# Altium project PCB_Project_1.PrjPcb
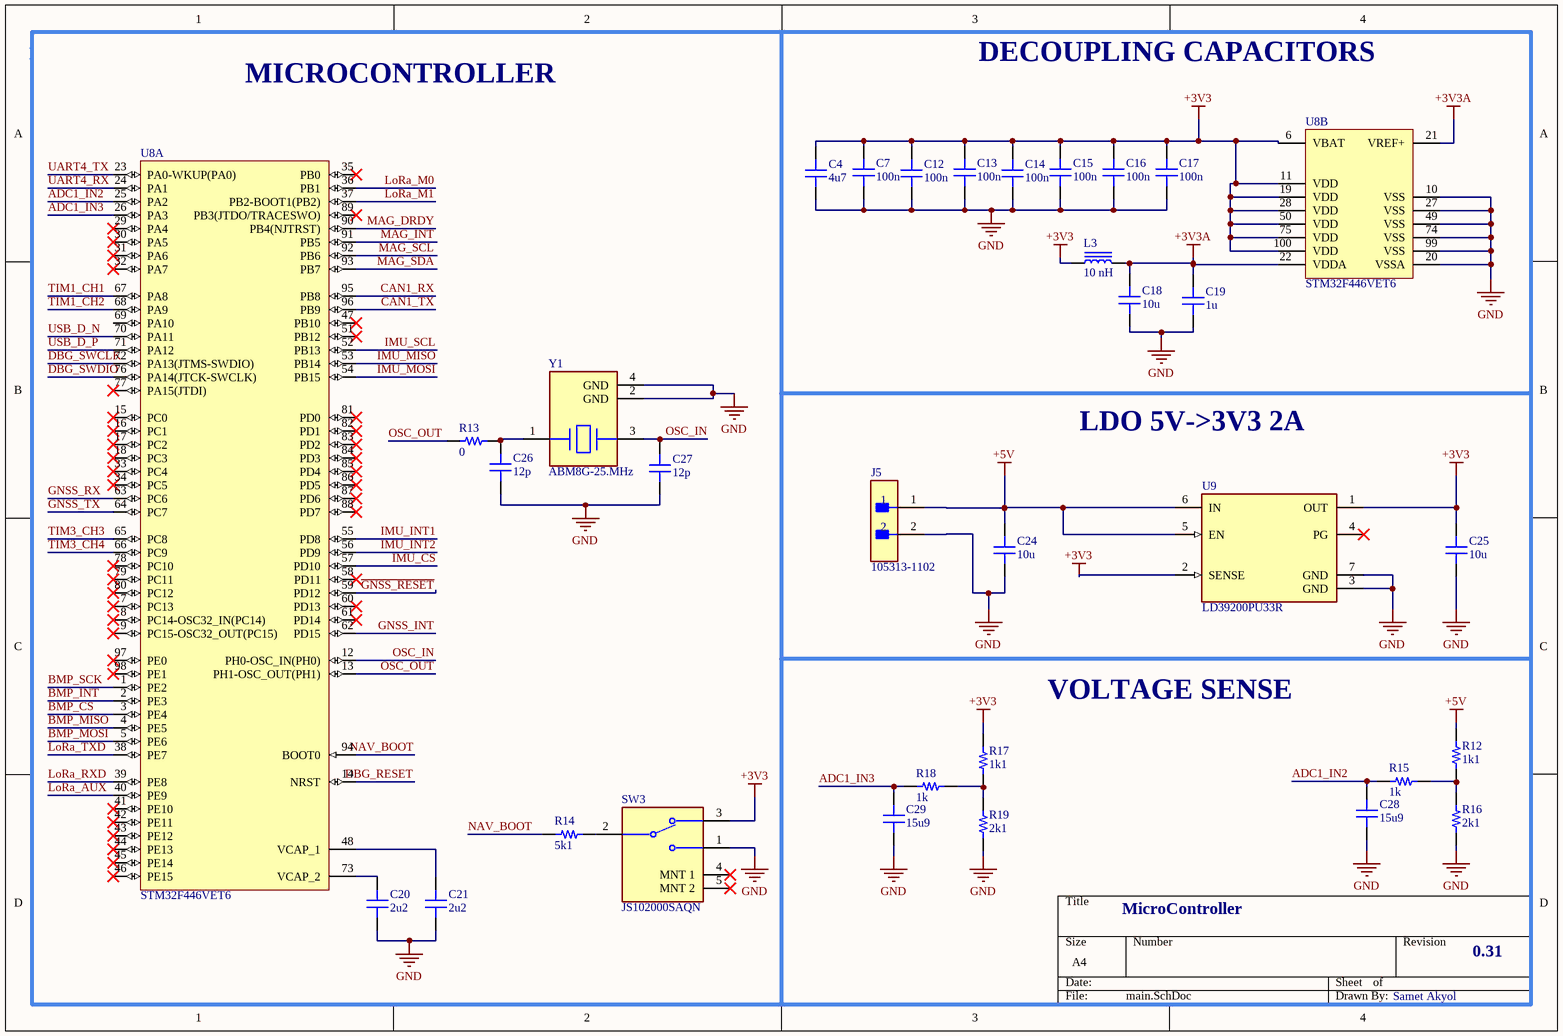
[diagram p0: main.SchDoc]
3 sheets, 75 parts. Net scope: global (net labels, ports and power ports of the same name join across sheets).
Board file: NAV_Computer.PcbDoc
Sheets:
  main.SchDoc
  Sensors.SchDoc
  Peripheral.SchDoc

## Sheet main.SchDoc: SSSSS
size A4; Date: 24.07.2024; Author: Samet Akyol; Revision: 0.1; SheetNumber: 1; SheetTotal: 3

### Parts
C4  4u7  [CAP 0402_1005]
C7  100n  [CAP 0402_1005]
C12  100n  [CAP 0402_1005]
C13  100n  [CAP 0402_1005]
C14  100n  [CAP 0402_1005]
C15  100n  [CAP 0402_1005]
C16  100n  [CAP 0402_1005]
C17  100n  [CAP 0402_1005]
C18  10u  [CAP 0402_1005]
C19  1u  [CAP 0402_1005]
C20  2u2  [CAP 0402_1005]
C21  2u2  [CAP 0402_1005]
C24  10u  [CAP 0603_1608]
C25  10u  [CAP 0603_1608]
C26  12p  [CAP 0402_1005]
C27  12p  [CAP 0402_1005]
C28  15u9  [CAP 0402_1005]
C29  15u9  [CAP 0402_1005]
J5  105313-1102  [FP-105313-1102-MFG]
L3  10 nH  [IND 0402_1005 RF WW]
R12  1k1  [RES 0402_1005]
R13  0  [RES 0402_1005]
R14  5k1  [RES 0402_1005]
R15  1k  [RES 0402_1005]
R16  2k1  [RES 0402_1005]
R17  1k1  [RES 0402_1005]
R18  1k  [RES 0402_1005]
R19  2k1  [RES 0402_1005]
SW3  JS102000SAQN  [FP-JS102000SAQN-MFG]
U8  STM32F446VET6  [STM-LQFP100_L]  (parts A,B of 2)
U9  LD39200PU33R  [FP-DFN6-7946637-MFG]
Y1  ABM8G-25.MHz  [FP-ABM8G-MFG]

### Nets
+3V3: C4.2 C7.2 C12.2 C13.2 C14.2 C15.2 C16.2 C17.2 C25.2 L3.1 R17.2 SW3.3 U8.6(VBAT) U8.11(VDD) U8.19(VDD) U8.28(VDD) U8.50(VDD) U8.75(VDD) U8.100(VDD) U9.1(OUT) U9.2(SENSE)
+3V3A: C18.2 C19.2 L3.2 U8.21(VREF+) U8.22(VDDA)
+5V: C24.2 J5.1 R12.2 U9.5(EN) U9.6(IN)
GND: C4.1 C7.1 C12.1 C13.1 C14.1 C15.1 C16.1 C17.1 C18.1 C19.1 C20.1 C21.1 C24.1 C25.1 C26.1 C27.1 C28.1 C29.1 J5.2 R16.2 R19.2 SW3.1 U8.10(VSS) U8.20(VSSA) U8.27(VSS) U8.49(VSS) U8.74(VSS) U8.99(VSS) U9.3(GND) U9.7(GND) Y1.2(GND) Y1.4(GND)
ADC1_IN2: C28.2 R15.2 U8.25(PA2)
ADC1_IN3: C29.2 R18.2 U8.26(PA3)
BMP_CS: U8.3(PE4)
BMP_INT: U8.2(PE3)
BMP_MISO: U8.4(PE5)
BMP_MOSI: U8.5(PE6)
BMP_SCK: U8.1(PE2)
CAN1_RX: U8.95(PB8)
CAN1_TX: U8.96(PB9)
DBG_RESET: U8.14(NRST)
DBG_SWCLK: U8.72(PA13(JTMS-SWDIO))
DBG_SWDIO: U8.76(PA14(JTCK-SWCLK))
~{GNSS_RESET}: U8.59(PD12)
GNSS_INT: U8.62(PD15)
GNSS_RX: U8.63(PC6)
GNSS_TX: U8.64(PC7)
IMU_CS: U8.57(PD10)
IMU_INT1: U8.55(PD8)
IMU_INT2: U8.56(PD9)
IMU_MISO: U8.53(PB14)
IMU_MOSI: U8.54(PB15)
IMU_SCL: U8.52(PB13)
LoRa_AUX: U8.40(PE9)
LoRa_M0: U8.36(PB1)
LoRa_M1: U8.37(PB2-BOOT1(PB2))
LoRa_RXD: U8.39(PE8)
LoRa_TXD: U8.38(PE7)
MAG_DRDY: U8.90(PB4(NJTRST))
MAG_INT: U8.91(PB5)
MAG_SCL: U8.92(PB6)
MAG_SDA: U8.93(PB7)
NAV_BOOT: R14.2 U8.94(BOOT0)
OSC_IN: C27.2 U8.12(PH0-OSC_IN(PH0)) Y1.3
OSC_OUT: R13.1 U8.13(PH1-OSC_OUT(PH1))
TIM1_CH1: U8.67(PA8)
TIM1_CH2: U8.68(PA9)
TIM3_CH3: U8.65(PC8)
TIM3_CH4: U8.66(PC9)
UART4_RX: U8.24(PA1)
UART4_TX: U8.23(PA0-WKUP(PA0))
USB_D_N: U8.70(PA11)
USB_D_P: U8.71(PA12)
NetC20_2: C20.2 U8.73(VCAP_2)
NetC21_2: C21.2 U8.48(VCAP_1)
NetC26_2: C26.2 R13.2 Y1.1
NetR12_1: R12.1 R15.1 R16.1
NetR14_1: R14.1 SW3.2(C)
NetR17_1: R17.1 R18.1 R19.1

Not connected (* = marked no-connect by the designer): SW3 4(MNT_1)* 5(MNT_2)*; U8 7(PC13)* 8(PC14-OSC32_IN(PC14))* 9(PC15-OSC32_OUT(PC15))* 15(PC0)* 16(PC1)* 17(PC2)* 18(PC3)* 29(PA4)* 30(PA5)* 31(PA6)* 32(PA7)* 33(PC4)* 34(PC5)* 35(PB0)* 41(PE10)* 42(PE11)* 43(PE12)* 44(PE13)* 45(PE14)* 46(PE15)* 47(PB10)* 51(PB12)* 58(PD11)* 60(PD13)* 61(PD14)* 69(PA10) 77(PA15(JTDI))* 78(PC10)* 79(PC11)* 80(PC12)* 81(PD0)* 82(PD1)* 83(PD2)* 84(PD3)* 85(PD4)* 86(PD5)* 87(PD6)* 88(PD7)* 89(PB3(JTDO/TRACESWO))* 97(PE0)* 98(PE1)*; U9 4(PG)*

### Notes on the sheet
- MICROCONTROLLER
- DECOUPLING CAPACITORS
- LDO 5V->3V3 2A
- VOLTAGE SENSE
- MicroController
- 0.31
- Samet Akyol

### Library data of the parts
C4 C7 C12-C21 C26-C29 = MD0402BB104K100NGHT-EM: CAP CER 0.1UF 10V X7R 0402; manufacturer: Knowles Novacap; Capacitance: 0.1 µF; Tolerance: ±10%; Part Number: MD0402BB104K100NGHT-EM; Applications: Medical, Non-Critical; componentlink1description: Datasheet; componentlink1url: https://mm.digikey.com/Volume0/opasdata/d220001/medias/docus/5546/MD Series R3.pdf; componentlink2description: DigiKey Link; componentlink2url: https://www.digikey.com/en/products/detail/knowles-novacap/MD0402BB104K100NGHT-EM/21406861; Device Package: 0402 (1005 Metric); lastupdated: 9.02.2024 20:03:17; Lifecycle Status: Active; Minimum Order: 1; Mounting Type: Surface Mount, MLCC; Operating Temperature: -55°C ~ 125°C; Package / Case: 0402 (1005 Metric); packaging: TapeAndReel; partid: 56675; price: 1.21; series: MD; Supplier 1: DigiKey; Supplier Part Number 1: 1763-MD0402BB104K100NGHT-EMCT-ND; Temperature Coefficient: X7R; Voltage - Rated: 10V
  C4: Value: 4u7
  C7 C12-C17: Value: 100n
  C18: Value: 10u
  C19: Value: 1u
  C20 C21: Value: 2u2
  C26 C27: Value: 12p
  C28 C29: Value: 15u9
C24 C25 = GRM1885C1H362JA01D: CAP CER 3600PF 50V C0G/NP0 0603; manufacturer: Murata Electronics; Temperature Coefficient: C0G, NP0; Tolerance: ±5%; Part Number: GRM1885C1H362JA01D; Value: 10u; Applications: General Purpose; Capacitance: 3600 pF; componentlink1description: Datasheet; componentlink1url: https://www.murata.com/~/media/webrenewal/support/library/catalog/products/capacitor/mlcc/c02e.ashx?la=en-us; componentlink2description: DigiKey Link; componentlink2url: https://www.digikey.com/en/products/detail/murata-electronics/GRM1885C1H362JA01D/2611163; Device Package: 0603 (1608 Metric); lastupdated: 9.02.2024 20:10:10; Lifecycle Status: Active; Minimum Order: 1; Mounting Type: Surface Mount, MLCC; Operating Temperature: -55°C ~ 125°C; Package / Case: 0603 (1608 Metric); packaging: TapeAndReel; partid: 15929; Part Status: Active; price: 0.01; series: GRM; Size / Dimension: 0.063" L x 0.031" W (1.60mm x 0.80mm); Supplier 1: DigiKey; Supplier Part Number 1: 490-6386-1-ND; Thickness (Max): 0.035" (0.90mm); Voltage - Rated: 50V
J5 = CMP-04776-000341-1: CONN HEADER R/A 2POS 2.5MM
L3 = LQW15AN10NG80D: FIXED IND 10NH 1.4A 0.081OHM SMD; Manufacturer: Murata Electronics; DC Resistance (DCR): 81mOhm Max; Frequency - Self Resonant: 6GHz; Inductance Frequency - Test: 100 MHz; Material - Core: Non-Magnetic; Q @ Freq: 31 @ 250MHz; Shielding: Unshielded; Tolerance: ±2%; Type: Drum Core, Wirewound; Part Number: LQW15AN10NG80D; ComponentLink1Description: Datasheet; ComponentLink1URL: https://search.murata.co.jp/Ceramy/image/img/P02/JELF243A-0100.pdf; ComponentLink2Description: DigiKey Link; ComponentLink2URL: https://www.digikey.com/en/products/detail/murata-electronics/LQW15AN10NG80D/4905881; Current Rating (Amps): 1.4 A; Device Package: 0402 (1005 Metric); Height - Seated (Max): 0.024" (0.60mm); Inductance: 10 nH; LastUpdated: 11.03.2024 07:55:40; Lifecycle Status: Active; Minimum Order: 1; Mounting Type: Surface Mount; Operating Temperature: -55°C ~ 125°C; Package / Case: 0402 (1005 Metric); Packaging: TapeAndReel; PartId: 162; Part Status: Active; Price: 0.07; Series: LQW15; Size / Dimension: 0.039" L x 0.024" W (1.00mm x 0.60mm); Supplier 1: DigiKey; Supplier Part Number 1: 490-14708-1-ND; Value: 10 nH
R12 R14-R19 = RP73PF1E249KBTD: RES 249K OHM 0.1% 1/10W 0402; Manufacturer: TE Connectivity Passive Product; Power (Watts): 0.1W, 1/10W; Resistance: 249 kOhms; Temperature Coefficient: ±25ppm/°C; Part Number: RP73PF1E249KBTD; ComponentLink1Description: Datasheet; ComponentLink1URL: https://www.te.com/commerce/DocumentDelivery/DDEController?Action=srchrtrv&DocNm=1773272&DocType=DS&DocLang=English; ComponentLink2Description: DigiKey Link; ComponentLink2URL: https://www.digikey.com/en/products/detail/te-connectivity-passive-product/RP73PF1E249KBTD/8261091; Composition: Thin Film; Device Package: 0402 (1005 Metric); Height - Seated (Max): 0.014" (0.35mm); LastUpdated: 9.02.2024 20:30:24; Lifecycle Status: Active; Minimum Order: 1; Number of Terminations: 2; Operating Temperature: -55°C ~ 155°C; Package / Case: 0402 (1005 Metric); Packaging: TapeAndReel; PartId: 2418; Part Status: Active; Price: 0.07; Series: RP73, Holsworthy; Size / Dimension: 0.039" L x 0.020" W (1.00mm x 0.50mm); Supplier 1: DigiKey; Supplier Part Number 1: A127549CT-ND; Supplier Device Package: 0402; Tolerance: ±0.1%
  R12 R17: Value: 1k1
  R14: Value: 5k1
  R15 R18: Value: 1k
  R16 R19: Value: 2k1
R13 = RC0402FR-07270RL: RES 270 OHM 1% 1/16W 0402; Manufacturer: Yageo; Power (Watts): 0.063W, 1/16W; Resistance: 270 Ohms; Temperature Coefficient: ±100ppm/°C; Part Number: RC0402FR-07270RL; Value: 0; ComponentLink1Description: Datasheet; ComponentLink1URL: https://www.yageo.com/upload/media/product/productsearch/datasheet/rchip/PYu-RC_Group_51_RoHS_L_10.pdf; ComponentLink2Description: DigiKey Link; ComponentLink2URL: https://www.digikey.com/en/products/detail/yageo/RC0402FR-07270RL/2827584; Composition: Thick Film; Device Package: 0402 (1005 Metric); Features: Moisture Resistant; Height - Seated (Max): 0.016" (0.40mm); LastUpdated: 9.02.2024 20:30:23; Lifecycle Status: Active; Minimum Order: 1; Number of Terminations: 2; Operating Temperature: -55°C ~ 155°C; Package / Case: 0402 (1005 Metric); Packaging: CutTape; PartId: 2573; Part Status: Active; Price: 0.01; Series: RC_L; Size / Dimension: 0.039" L x 0.020" W (1.00mm x 0.50mm); Supplier 1: DigiKey; Supplier Part Number 1: 311-270LRCT-ND; Supplier Device Package: 0402; Tolerance: ±1%
SW3 = CMP-10038-000025-1: SWITCH SLIDE SPDT 1MA 5V; Actuator Material: Nylon; Contact Resistance: 70mR; Electrical Life: 15000Cycles; Actuator Length: 1.5mm; Switch Function: On-On; Actuator Type: Standard; Actuator Color: Black; Current Rating: 1mA; Throw Configuration: SPDT; Termination: Gull Wing; Housing Material: Nylon; Max Operating Temperature: 85°C; Max Voltage Rating (DC): 5V; Voltage Rating (DC): 5V; Contact Plating: Silver; Radiation Hardening: No; Package Quantity: 1; REACH SVHC: No SVHC; RoHS Compliant: Yes; Orientation: Right Angle; Max Current Rating: 1mA; Case/Package: SMD/SMT; Contact Current Rating: 1mA; Contact Material: Copper Alloy; Mount: Surface Mount; Flammability Rating: UL94 V-2; Packaging: Tape and Reel; Switch Travel: 1.5mm; Length: 7.8mm; Series: JS; Min Operating Temperature: -20°C; Depth: 4.82mm
U8 = CMP-0243-00220-1: ARM Cortex-M4 32-bit MCU+FPU, 512 KB Flash, 128 KB Internal RAM, 81 I/Os, 100-Pin LQFP, -40 to 85 degC, Tray; I/Os (High Current): 81; D/A Converter: 2; Internal RAM Size (kB): 128; FLASH Size (Prog) (kB): 512; Supply Voltage(Vcc) min (V): 1.7; Operating Frequency(F) (Processor speed) (MHz): 180; ComponentLink1Description: Manufacturer URL; ComponentLink1URL: http://www.st.com/; Core: ARM Cortex-M4; DatasheetVersion: Rev. 6; ComponentLink2Description: Datasheet; Package Description: LQFP100; Mounting Technology: Surface Mount; Package Reference: 100-Pin Low Profile Quad Flat Package, Body 14 x 14 mm, Pitch 0.5 mm; Packing: Tray; ComponentLink2URL: http://www.st.com/st-web-ui/static/active/en/resource/technical/document/datasheet/DM00141306.pdf
U9 = CMP-12153-000011-1: IC REG LINEAR 3.3V 2A 6DFN; Number of Outputs: 1; Max Input Voltage: 6V; Output Type: Fixed; Min Input Voltage: 1.25V; Dropout Voltage: 130mV; Operating Supply Current: 1mA; Number of Regulators: 1; Case/Package: DFN; Packaging: Tape and Reel; Output Current: 2A; Min Operating Temperature: -40°C; Mount: Surface Mount; Output Voltage: 3.3V; Max Operating Temperature: 125°C; Lead Free: Lead Free; Package Quantity: 3000
Y1 = CMP-2000-05733-3: Crystal 25MHz ±20ppm (Tol) ±30ppm (Stability) 18pF FUND 60Ω 4-Pin SMD T/R; Series Resistance: 60R; Length: 3.2mm; Depth: 2.5mm; Packaging: Tape and Reel; Min Operating Temperature: -40°C; Operating Frequency: 25 MHz; Lead Free: Lead Free; Number of Pins: 4; Frequency Tolerance: 20ppm; Radiation Hardening: No; Max Operating Temperature: 85°C; Termination: SMD/SMT; Frequency Stability: 30ppm; Frequency: 25MHz; Series: ABM8G; Mount: Surface Mount; Package Quantity: 1000; Height: 0.039inch; Width: 0.098inch; Case/Package: CSMD; ESR (Equivalent Series Resistance): 60R; Load Capacitance: 18pF; Tolerance: 20ppm

## Sheet Sensors.SchDoc
size A4; SheetNumber: 2; SheetTotal: 3
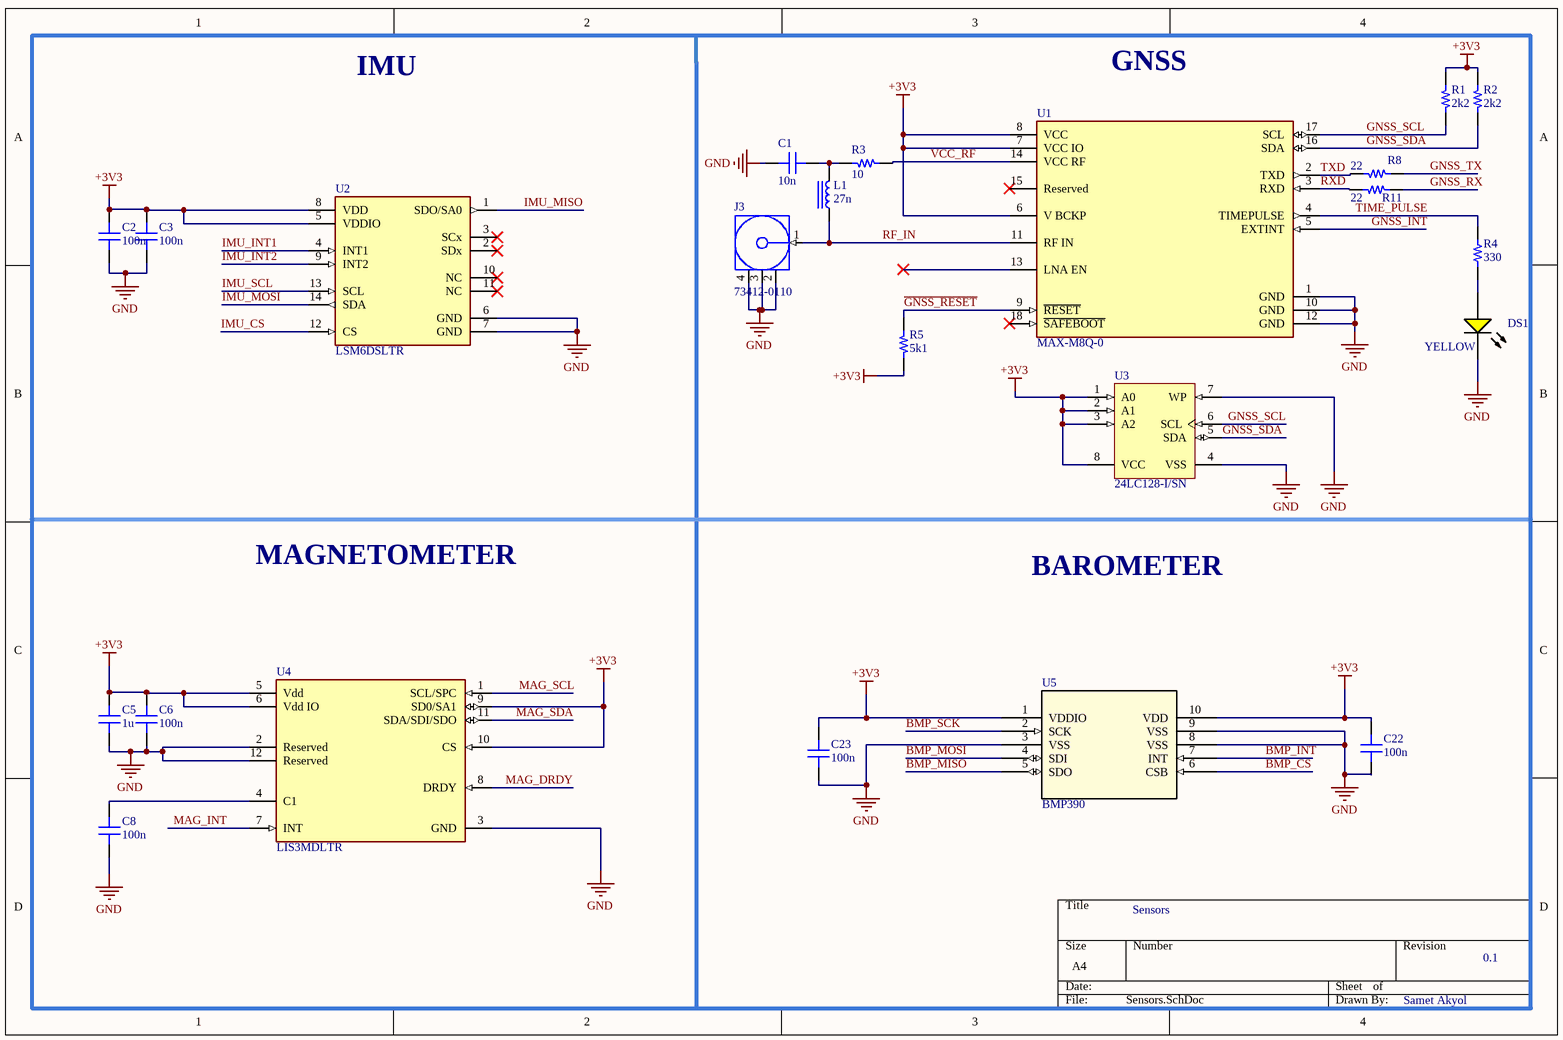
[diagram p1: Sensors.SchDoc]

### Parts
C1  10n  [CAP 0402_1005]
C2  100n  [CAP 0402_1005]
C3  100n  [CAP 0402_1005]
C5  1u  [CAP 0402_1005]
C6  100n  [CAP 0402_1005]
C8  100n  [CAP 0402_1005]
C22  100n  [CAP 0402_1005]
C23  100n  [CAP 0402_1005]
DS1  YELLOW  [VISH-TLMY1000_V]
J3  73412-0110  [MOLX-73412-0110_V]
L1  27n  [IND 0402_1005 RF WW]
R1  2k2  [RES 0402_1005]
R2  2k2  [RES 0402_1005]
R3  10  [RES 0402_1005]
R4  330  [RES 0603_1608]
R5  5k1  [RES 0402_1005]
R8  22  [RES 0402_1005]
R11  22  [RES 0402_1005]
U1  MAX-M8Q-0  [FP-MAX-M8Q-0-MFG]
U2  LSM6DSLTR  [FP-LGA-14L-DM00249496-MFG]
U3  24LC128-I/SN  [SOIC-SN8_M]
U4  LIS3MDLTR  [FP-VFLGA-12-8365767-MFG]
U5  BMP390  [10LGA_2X2X0p75_BOS-L]

### Nets
+3V3: C2.2 C3.2 C5.2 C6.2 C22.2 C23.2 R1.2 R2.2 R5.1 U1.6(V_BCKP) U1.7(VCC_IO) U1.8(VCC) U2.5(VDDIO) U2.8(VDD) U3.1(A0) U3.2(A1) U3.3(A2) U3.8(VCC) U4.5(Vdd) U4.6(Vdd_IO) U4.9(SD0/SA1) U4.10(CS) U5.1(VDDIO) U5.10(VDD)
GND: C1.2 C2.1 C3.1 C5.1 C6.1 C8.1 C22.1 C23.1 DS1.2(K) J3.2(GND) J3.3(GND) J3.4(GND) U1.1(GND) U1.10(GND) U1.12(GND) U2.6(GND) U2.7(GND) U3.4(VSS) U3.7(WP) U4.2(Reserved) U4.3(GND) U4.12(Reserved) U5.3(VSS) U5.8(VSS) U5.9(VSS)
BMP_CS: U5.6(CSB)
BMP_INT: U5.7(INT)
BMP_MISO: U5.5(SDO)
BMP_MOSI: U5.4(SDI)
BMP_SCK: U5.2(SCK)
~{GNSS_RESET}: R5.2 U1.9(~{RESET})
GNSS_INT: U1.5(EXTINT)
GNSS_RX: R11.1
GNSS_SCL: R1.1 U1.17(SCL) U3.6(SCL)
GNSS_SDA: R2.1 U1.16(SDA) U3.5(SDA)
GNSS_TX: R8.1
IMU_CS: U2.12(CS)
IMU_INT1: U2.4(INT1)
IMU_INT2: U2.9(INT2)
IMU_MISO: U2.1(SDO/SA0)
IMU_MOSI: U2.14(SDA)
IMU_SCL: U2.13(SCL)
MAG_DRDY: U4.8(DRDY)
MAG_INT: U4.7(INT)
MAG_SCL: U4.1(SCL/SPC)
MAG_SDA: U4.11(SDA/SDI/SDO)
RF_IN: J3.1(SIGNAL) L1.2 U1.11(RF_IN)
RXD: R11.2 U1.3(RXD)
TIME_PULSE: R4.2 U1.4(TIMEPULSE)
TXD: R8.2 U1.2(TXD)
VCC_RF: R3.2 U1.14(VCC_RF)
NetC1_1: C1.1 L1.1 R3.1
NetC8_2: C8.2 U4.4(C1)
NetDS1_1: DS1.1(A) R4.1

Not connected (* = marked no-connect by the designer): U1 13(LNA_EN)* 15(Reserved)* 18(~{SAFEBOOT})*; U2 2(SDx)* 3(SCx)* 10(NC)* 11(NC)*

### Notes on the sheet
- IMU <https://www.st.com/resource/en/datasheet/lsm6dsl.pdf>
- GNSS <https://www.u-blox.com/en/product/max-m8-series?legacy=Current#Documentation-&-resources>
- MAGNETOMETER
- BAROMETER
- Sensors
- 0.1
- Samet Akyol

### Library data of the parts
C1 = C0402C151F5GAC7867: CAP CER 150PF 50V NP0 0402; manufacturer: KEMET; Temperature Coefficient: C0G, NP0; Tolerance: ±1%; Part Number: C0402C151F5GAC7867; Value: 10n; Applications: General Purpose; Capacitance: 150 pF; componentlink1description: Datasheet; componentlink1url: https://api.kemet.com/component-edge/download/datasheet/C0402C151F5GAC7867.pdf; componentlink2description: DigiKey Link; componentlink2url: https://www.digikey.com/en/products/detail/kemet/C0402C151F5GAC7867/2196312; Device Package: 0402 (1005 Metric); Features: Low ESL; lastupdated: 9.02.2024 20:04:38; Lifecycle Status: Active; Minimum Order: 1; Mounting Type: Surface Mount, MLCC; Operating Temperature: -55°C ~ 125°C; Package / Case: 0402 (1005 Metric); packaging: TapeAndReel; partid: 1709; Part Status: Active; price: 0.40; series: SMD Comm C0G; Size / Dimension: 0.039" L x 0.020" W (1.00mm x 0.50mm); Supplier 1: DigiKey; Supplier Part Number 1: 399-14269-1-ND; Thickness (Max): 0.022" (0.55mm); Voltage - Rated: 50V
C2 C3 C5 C6 C8 C22 C23 = MD0402BB104K100NGHT-EM: as C4 on sheet main; Part Number: MD0402BB104K100NGHT-EM; Applications: Medical, Non-Critical; componentlink1description: Datasheet; componentlink1url: https://mm.digikey.com/Volume0/opasdata/d220001/medias/docus/5546/MD Series R3.pdf; componentlink2description: DigiKey Link; componentlink2url: https://www.digikey.com/en/products/detail/knowles-novacap/MD0402BB104K100NGHT-EM/21406861; Device Package: 0402 (1005 Metric); lastupdated: 9.02.2024 20:03:17; Lifecycle Status: Active; Minimum Order: 1; Mounting Type: Surface Mount, MLCC; Operating Temperature: -55°C ~ 125°C; Package / Case: 0402 (1005 Metric); packaging: TapeAndReel; partid: 56675; price: 1.21; series: MD; Supplier 1: DigiKey; Supplier Part Number 1: 1763-MD0402BB104K100NGHT-EMCT-ND; Temperature Coefficient: X7R; Voltage - Rated: 10V
  C2 C3 C6 C8 C22 C23: Value: 100n
  C5: Value: 1u
DS1 = CMP-2000-07255-1: Low Current LED, 40 mW, -40 to 100 degC, 2-Pin SMD, RoHS, Tape and Reel; Manufacturer: Vishay; Wavelength Typ: 595nm; Forward Current If: 2mA; Viewing Angle: 80°; Bulb Size: 1.6mmx0.8mm; Forward Voltage: 1.8V; Luminous Intensity: 7.5mcd; SVHC: ToBeAdvised; Automotive Qualification Standard: AEC-Q100; Lens Shape: Rectangular; LED Mounting: SMD; Mounting Technology: SurfaceMount; Packaging: CutTape; MSL: MSL2-1year; Datasheet URL: http://www.vishay.com/docs/83172/tlmo1000.pdf; Package Reference: TLMY1000; Manufacturer URL: http://www.vishay.com/; Package Description: 2-Pin Surface Mount Device, Body 1.6 x 0.8 mm; LED Colour: Yellow; Datasheet Version: Rev. 2.0, 09/2013; Product Range: -
J3 = CMP-1676-00003-1: MCRF, PCB Vertical Jack Receptacle, 50 Ohm, 4-Pin SMD, RoHS, Tape and Reel; Voltage Rating (AC): 60 V; Mating Cycles: 30; Impedance: 50 Ohm; Frequency: 6 Hz; Gender: Female; RoHSCompliant: true; Length: 3 mm; DatasheetVersion: 04/2016; ComponentLink3URL: http://www.molex.com/pdm_docs/sd/734120110_sd.pdf; Max Operating Temperature: 90 degC; Contact Material: Bronze; Mount: Surface Mount; ComponentLink2Description: Datasheet; Packaging: Tape and Reel; Radiation Hardening: No; Voltage Rating: 60 V; Mounting Technology: Surface Mount; ComponentLink1Description: Manufacturer URL; ComponentLink1URL: http://www.molex.com/; Width: 3 mm; ComponentLink3Description: Package Specification; Package Quantity: 5000; PackageReference: 73412-0110; Min Operating Temperature: -40 degC; Height: 1.25 mm; REACH SVHC: Unknown; ComponentLink2URL: http://www.molex.com/webdocs/datasheets/pdf/en-us/0734120110_RF_COAX_CONNECTORS.pdf; Contact Plating: Gold; PackageDescription: 4-Leads SMD, Body 2.6 x 2.6 mm; PackageVersion: Rev. C14, 07/2015
L1 = LQW15CNR16J00D: FIXED IND 160NH 480MA 0.33OHM SM; Manufacturer: Murata Electronics; DC Resistance (DCR): 330mOhm Max; Frequency - Self Resonant: 900MHz; Inductance Frequency - Test: 100 MHz; Material - Core: Ferrite; Shielding: Unshielded; Tolerance: ±5%; Type: Drum Core, Wirewound; Part Number: LQW15CNR16J00D; ComponentLink1Description: Datasheet; ComponentLink1URL: https://search.murata.co.jp/Ceramy/image/img/P02/JELF243A-0087.pdf; ComponentLink2Description: DigiKey Link; ComponentLink2URL: https://www.digikey.com/en/products/detail/murata-electronics/LQW15CNR16J00D/4359664; Current Rating (Amps): 480 mA; Device Package: 0402 (1005 Metric); Height - Seated (Max): 0.024" (0.60mm); Inductance: 160 nH; LastUpdated: 11.03.2024 07:55:42; Lifecycle Status: Active; Minimum Order: 1; Mounting Type: Surface Mount; Operating Temperature: -55°C ~ 125°C; Package / Case: 0402 (1005 Metric); Packaging: TapeAndReel; PartId: 1; Part Status: Active; Price: 0.19; Series: LQW15; Size / Dimension: 0.039" L x 0.024" W (1.00mm x 0.60mm); Supplier 1: DigiKey; Supplier Part Number 1: 490-14716-1-ND; Value: 160 nH
R1-R3 R5 R8 R11 = RP73PF1E249KBTD: as R12 on sheet main; Part Number: RP73PF1E249KBTD; ComponentLink1Description: Datasheet; ComponentLink1URL: https://www.te.com/commerce/DocumentDelivery/DDEController?Action=srchrtrv&DocNm=1773272&DocType=DS&DocLang=English; ComponentLink2Description: DigiKey Link; ComponentLink2URL: https://www.digikey.com/en/products/detail/te-connectivity-passive-product/RP73PF1E249KBTD/8261091; Composition: Thin Film; Device Package: 0402 (1005 Metric); Height - Seated (Max): 0.014" (0.35mm); LastUpdated: 9.02.2024 20:30:24; Lifecycle Status: Active; Minimum Order: 1; Number of Terminations: 2; Operating Temperature: -55°C ~ 155°C; Package / Case: 0402 (1005 Metric); Packaging: TapeAndReel; PartId: 2418; Part Status: Active; Price: 0.07; Series: RP73, Holsworthy; Size / Dimension: 0.039" L x 0.020" W (1.00mm x 0.50mm); Supplier 1: DigiKey; Supplier Part Number 1: A127549CT-ND; Supplier Device Package: 0402; Tolerance: ±0.1%
  R1 R2: Value: 2k2
  R3: Value: 10
  R5: Value: 5k1
  R8 R11: Value: 22
R4 = CRGH0603F330R: RES SMD 330 OHM 1% 1/5W 0603; Manufacturer: TE Connectivity Passive Product; Power (Watts): 0.2W, 1/5W; Resistance: 330 Ohms; Temperature Coefficient: ±100ppm/°C; Part Number: CRGH0603F330R; Value: 330; ComponentLink1Description: Datasheet; ComponentLink1URL: https://www.te.com/commerce/DocumentDelivery/DDEController?Action=srchrtrv&DocNm=1773204-1&DocType=DS&DocLang=English; ComponentLink2Description: DigiKey Link; ComponentLink2URL: https://www.digikey.com/en/products/detail/te-connectivity-passive-product/CRGH0603F330R/5586961; Composition: Thick Film; Device Package: 0603 (1608 Metric); Height - Seated (Max): 0.022" (0.55mm); LastUpdated: 9.02.2024 20:43:33; Lifecycle Status: Active; Minimum Order: 1; Number of Terminations: 2; Operating Temperature: -55°C ~ 155°C; Package / Case: 0603 (1608 Metric); Packaging: TapeAndReel; PartId: 5733; Part Status: Active; Price: 0.01; Series: CRGH, Neohm; Size / Dimension: 0.063" L x 0.031" W (1.60mm x 0.80mm); Supplier 1: DigiKey; Supplier Part Number 1: A129541CT-ND; Supplier Device Package: 0603; Tolerance: ±1%
U1 = CMP-207130-000017-1: RF RCVR GNSS/GPS 1.575GHZ 18LCC; Sensitivity: -167dBm; Current - Receiving: 23mA; Interface: I2C; Frequency: 1.575GHz; Min Operating Temperature: -40°C; Case/Package: SMD/SMT; RoHS Compliant: Yes; Packaging: Cut Tape; Max Operating Temperature: 85°C
U2 = CMP-2000-07467-2: IMU ACCEL/GYRO I2C/SPI 14LGA; Manufacturer: STMicroelectronics; Resolution: 16bits; Max Supply Voltage: 3.6V; Sensor Type: Temperature,Accelerometer,Gyroscope; Sensor Output: I2C,SPI; Gyro Range: 125/250/500/1000/2000°/s; Accel Range: 2/4/8/16g; Operating Supply Current: 0.29-0.65mA; Min Supply Voltage: 1.62V; Package: LGA-14L-DM00249496; Temperature Range High: +85°C; Automotive: No; Footprint Url: https://www.st.com/resource/en/technical_note/cd00134799.pdf; Height: 0.86mm; Device Class L1: Sensors; Octopart: https://octopart.com/lsm6dsltr-stmicroelectronics-66358193; Device Class L2: Motion Sensors; Lead Free: Yes; Category: IC; Device Class L3: Inertial Measurement Units (IMUs); ComponentLink2Description: Datasheet; RoHS: TRUE; ComponentLink2URL: https://www.st.com/resource/en/datasheet/lsm6dsl.pdf; Temperature Range Low: -40°C; Manufacturer Part Number: LSM6DSLTR; Mouser Description: iNEMO inertial module: always-on 3D accelerometer and 3D gyroscope; Digikey Description: IMU ACCEL/GYRO I2C/SPI 14LGA; Temperature: -40°C to +85°C
U3 = CMP-0159-00176-1: 128Kbit, 400kHz, 2.5V, I2C Serial EEPROM, 8-Pin SOIC 150mil, Industrial Temperature; PackageReference: SOIC-SN8; Code_JEDEC: MS-012; DatasheetVersion: revR, Apr-2009; PackageVersion: revBB, Aug-2009; Code_IPC: SOIC127P600-8; PackageDescription: 8-Lead Plastic Small Outline (SN) - Narrow, 3.90mm Body [SOIC]
U4 = CMP-2000-07463-2: SENSOR MR I2C/SPI 12LGA; Manufacturer: STMicroelectronics; Sensor Output: I2C,SPI; Operating Supply Current: 40-270uA; Max Supply Voltage: 3.6V; Sensing Method: Magnetic; Min Supply Voltage: 1.71V; ComponentLink2URL: https://www.st.com/resource/en/datasheet/lis3mdl.pdf; Category: IC; Manufacturer Part Number: LIS3MDLTR; Octopart: https://octopart.com/lis3mdltr-stmicroelectronics-29403125; Automotive: No; ComponentLink2Description: Datasheet; RoHS: TRUE; Device Class L3: unset; Device Class L1: Sensors; Temperature: -40°C to +85°C; Height: 1mm; Mouser Description: Board Mount Hall Effect / Magnetic Sensors Ultra Lo-Pwr Hi Perf 3-Axis 1.9-3.6V; Temperature Range High: +85°C; Lead Free: Yes; Device Class L2: Magnetic Sensors; Footprint Url: https://www.st.com/content/ccc/resource/technical/document/technical_note/73/17/9c/16/dd/96/4a/01/CD00134799.pdf/files/CD00134799.pdf/jcr:content/translations/en.CD00134799.pdf; Temperature Range Low: -40°C; Package: VFLGA-12-8365767; Digikey Description: SENSOR MR I2C/SPI 12LGA
U5 = BMP390: No Description Available; Mfr_Name: Bosch Sensortec; RefDes: RefDes; Type: Type

## Sheet Peripheral.SchDoc
size A4; SheetNumber: 3; SheetTotal: 3
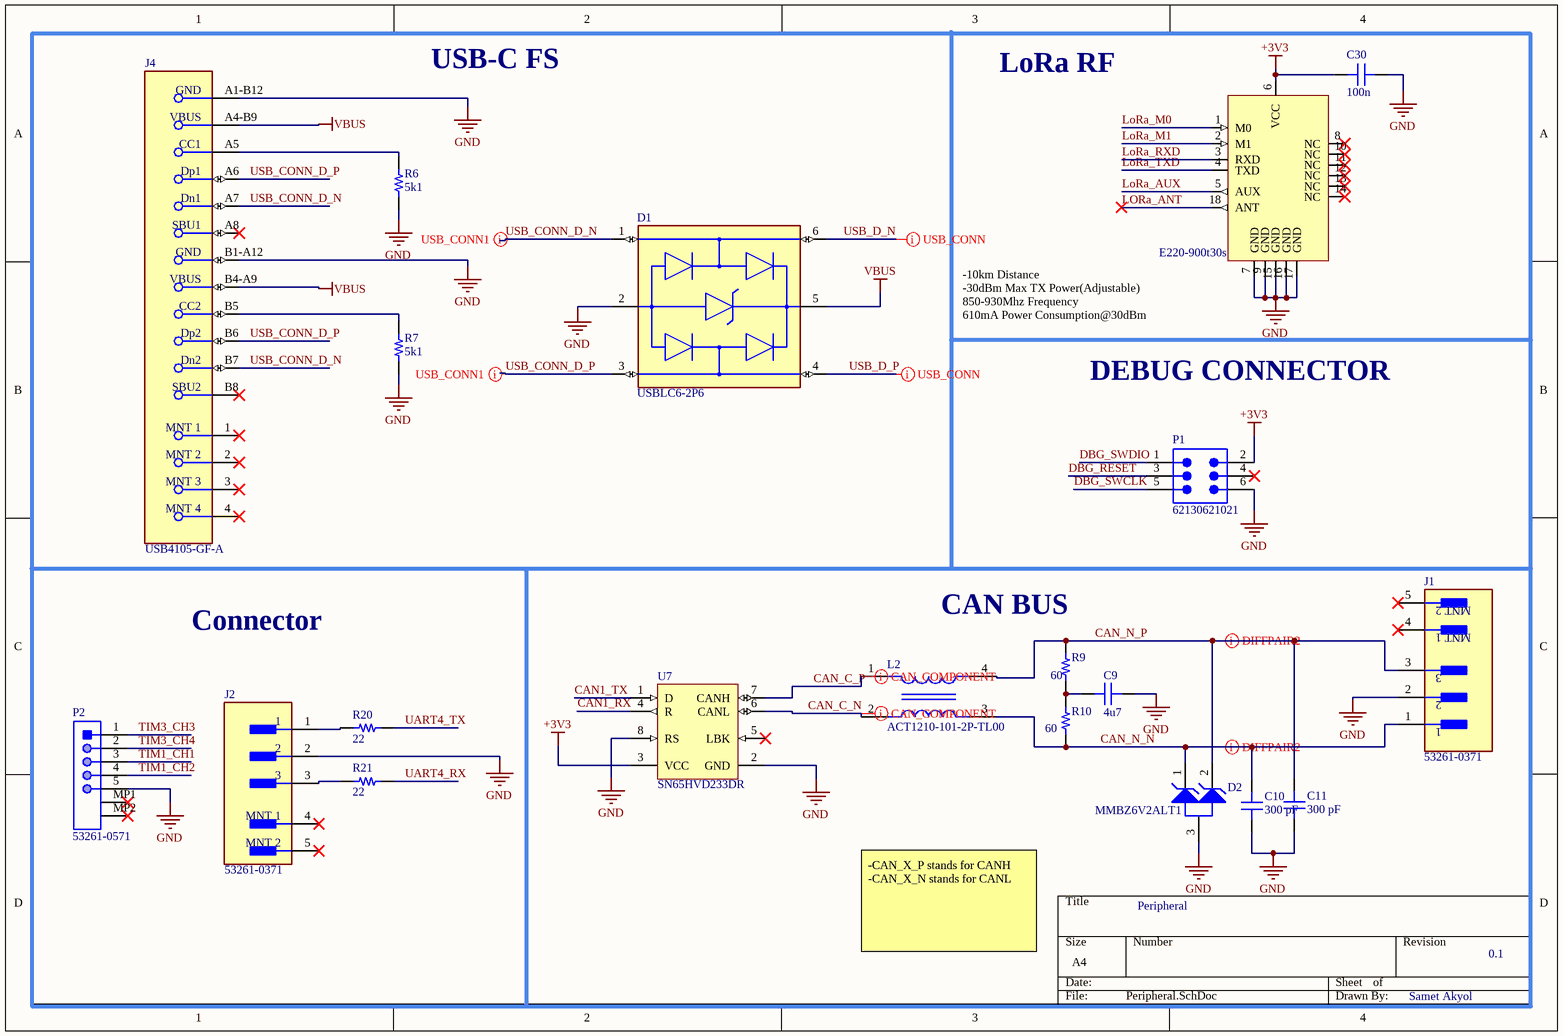
[diagram p2: Peripheral.SchDoc]

### Parts
C9  4u7  [CAP 0603_1608]
C10  300 pF  [CAP 0402_1005]
C11  300 pF  [CAP 0402_1005]
C30  100n  [CAP 0603_1608]
D1  USBLC6-2P6  [FP-SOT-666-MFG]
D2  MMBZ6V2ALT1  [ONSC-SOT-23-3-318-08_V]
J1  53261-0371  [FP-53261-0371-MFG]
J2  53261-0371  [FP-53261-0371-MFG]
J4  USB4105-GF-A  [FP-USB4105-GF-A-MFG]
L2  ACT1210-101-2P-TL00  [FP-ACT1210-MFG]
P1  62130621021  [62130621021]
P2  53261-0571  [MOLX-52361-0571-5_V]
R6  5k1  [RES 0402_1005]
R7  5k1  [RES 0402_1005]
R9  60  [RES 0603_1608]
R10  60  [RES 0603_1608]
R20  22  [RES 0603_1608]
R21  22  [RES 0603_1608]
U7  SN65HVD233DR  [D0008A_M]
U31  Comment  [PE220-900T30S]  (value not drawn)  (parts A,B of 2)

### Nets
+3V3: C30.1 P1.2 U7.3(VCC) U31.6(VCC)
GND: C9.2 C10.1 C11.1 C30.2 D1.2(GND) D2.3(A) J1.2 J2.2 J4.A1-B12(GND) J4.B1-A12(GND) P1.6 P2.5 R6.1 R7.1 U7.2(GND) U7.8(RS) U31.7(GND) U31.9(GND) U31.15(GND) U31.16(GND) U31.17(GND)
VBUS: D1.5(VBUS) J4.A4-B9(VBUS) J4.B4-A9(VBUS)
CAN1_RX: U7.4(R)
CAN1_TX: U7.1(D)
CAN_C_N: L2.2 U7.6(CANL)
CAN_C_P: L2.1 U7.7(CANH)
CAN_N_N: C10.2 D2.1(K1) J1.1 L2.3 R10.1
CAN_N_P: C11.2 D2.2(K2) J1.3 L2.4 R9.2
DBG_RESET: P1.3
DBG_SWCLK: P1.5
DBG_SWDIO: P1.1
LORa_ANT: U31.18(ANT)
LoRa_AUX: U31.5(AUX)
LoRa_M0: U31.1(M0)
LoRa_M1: U31.2(M1)
LoRa_RXD: U31.3(RXD)
LoRa_TXD: U31.4(TXD)
TIM1_CH1: P2.3
TIM1_CH2: P2.4
TIM3_CH3: P2.1
TIM3_CH4: P2.2
UART4_RX: R21.1
UART4_TX: R20.1
USB_CONN_D_N: D1.1(I/O1) J4.A7(Dn1) J4.B7(Dn2)
USB_CONN_D_P: D1.3(I/O2) J4.A6(Dp1) J4.B6(Dp2)
USB_D_N: D1.6(I/O1)
USB_D_P: D1.4(I/O2)
NetC9_1: C9.1 R9.1 R10.2
NetJ2_1: J2.1 R20.2
NetJ2_3: J2.3 R21.2
NetJ4_A5: J4.A5(CC1) R6.2
NetJ4_B5: J4.B5(CC2) R7.2

Not connected (* = marked no-connect by the designer): J1 4(MNT_1)* 5(MNT_2)*; J2 4(MNT_1)* 5(MNT_2)*; J4 1(MNT_1)* 2(MNT_2)* 3(MNT_3)* 4(MNT_4)* A8(SBU1)* B8(SBU2)*; P1 4*; P2 MP1* MP2*; U7 5(LBK)*; U31 8(NC)* 10(NC)* 11(NC)* 12(NC)* 13(NC)* 14(NC)*

### Layout directives
differential pair: CAN_C_N, CAN_C_P, CAN_N_P, USB_CONN_D_N, USB_CONN_D_P, USB_D_N, USB_D_P

### Notes on the sheet
- USB-C FS
- LoRa RF
- -10km Distance
  -30dBm Max TX Power(Adjustable)
  850-930Mhz Frequency
  610mA Power Consumption@30dBm
- DEBUG CONNECTOR
- Connector
- CAN BUS
- Peripheral
- -CAN_X_P stands for CANH
  -CAN_X_N stands for CANL
- 0.1
- Samet Akyol

### Library data of the parts
C9 = CL10A475KA8NQNC: CAP CER 4.7UF 25V X5R 0603; manufacturer: Samsung Electro-Mechanics; Capacitance: 4.7 µF; Tolerance: ±10%; Part Number: CL10A475KA8NQNC; Value: 4u7; Applications: General Purpose; componentlink1description: Datasheet; componentlink1url: http://www.samsungsem.com/kr/support/product-search/mlcc/CL10A475KA8NQNC.jsp; componentlink2description: DigiKey Link; componentlink2url: https://www.digikey.com/en/products/detail/samsung-electro-mechanics/CL10A475KA8NQNC/3887558; Device Package: 0603 (1608 Metric); lastupdated: 9.02.2024 20:10:30; Lifecycle Status: Active; Minimum Order: 1; Mounting Type: Surface Mount, MLCC; Operating Temperature: -55°C ~ 85°C; Package / Case: 0603 (1608 Metric); packaging: TapeAndReel; partid: 2349; Part Status: Active; price: 0.06; series: CL; Size / Dimension: 0.063" L x 0.031" W (1.60mm x 0.80mm); Supplier 1: DigiKey; Supplier Part Number 1: 1276-1900-1-ND; Temperature Coefficient: X5R; Thickness (Max): 0.035" (0.90mm); Voltage - Rated: 25V
C10 C11 = C0402C301J3GAC7867: CAP CER 300PF 25V C0G/NP0 0402; manufacturer: KEMET; Temperature Coefficient: C0G, NP0; Tolerance: ±5%; Part Number: C0402C301J3GAC7867; Value: 300 pF; Applications: General Purpose; Capacitance: 300 pF; componentlink1description: Datasheet; componentlink1url: https://api.kemet.com/component-edge/download/datasheet/C0402C301J3GAC7867.pdf; componentlink2description: DigiKey Link; componentlink2url: https://www.digikey.com/en/products/detail/kemet/C0402C301J3GAC7867/7382019; Device Package: 0402 (1005 Metric); Features: Low ESL; lastupdated: 9.02.2024 20:04:37; Lifecycle Status: Active; Minimum Order: 1; Mounting Type: Surface Mount, MLCC; Operating Temperature: -55°C ~ 125°C; Package / Case: 0402 (1005 Metric); packaging: TapeAndReel; partid: 2000; Part Status: Active; price: 0.09; series: SMD Comm C0G; Size / Dimension: 0.039" L x 0.020" W (1.00mm x 0.50mm); Supplier 1: DigiKey; Supplier Part Number 1: 399-14903-1-ND; Thickness (Max): 0.022" (0.55mm); Voltage - Rated: 25V
C30 = 100X14W104MV4T: CAP CER 0.1UF 10V X7R 0603; manufacturer: Johanson Dielectrics Inc.; Capacitance: 0.1 µF; Tolerance: ±20%; Part Number: 100X14W104MV4T; Value: 100n; Applications: Bypass, Decoupling; componentlink1description: Datasheet; componentlink1url: https://www.johansondielectrics.com/downloads/x2y-filter-and-decoupling-capacitors.pdf; componentlink2description: DigiKey Link; componentlink2url: https://www.digikey.com/en/products/detail/johanson-dielectrics-inc/100X14W104MV4T/1655914; Device Package: 0603 (1608 Metric); Features: Low ESL (X2Y); lastupdated: 9.02.2024 20:10:30; Lifecycle Status: Active; Minimum Order: 1; Mounting Type: Surface Mount, MLCC; Operating Temperature: -55°C ~ 125°C; Package / Case: 0603 (1608 Metric); packaging: TapeAndReel; partid: 2680; Part Status: Active; price: 0.08; series: X2Y®; Size / Dimension: 0.064" L x 0.035" W (1.63mm x 0.89mm); Supplier 1: DigiKey; Supplier Part Number 1: 709-1101-1-ND; Temperature Coefficient: X7R; Thickness (Max): 0.026" (0.66mm); Voltage - Rated: 10V
D1 = CMP-12225-000058-1: TVS DIODE 5.25V 17V SOT666; Min Breakdown Voltage: 6V; Power Line Protection: Yes; Element Configuration: Dual; Test Current: 1mA; Working Voltage: 5V; Number of Channels: 2; Max Reverse Leakage Current: 150nA; Direction: Unidirectional; Peak Pulse Current: 5A; Number of Elements: 1; Capacitance: 3.5pF; Max Breakdown Voltage: 6V; Height: 0.6mm; Depth: 1.3mm; Contact Plating: Tin; Reverse Breakdown Voltage: 6V; REACH SVHC: No SVHC; Operating Supply Voltage: 5V; Width: 1.3mm; Max Operating Temperature: 125°C; Reverse Standoff Voltage: 5V; ESD Protection: Yes; Package Quantity: 1; Termination: SMD/SMT; Length: 1.7mm; Leakage Current: 150nA; Number of Bidirectional Channels: 2; Case/Package: SOT-666; Min Operating Temperature: -40°C; Number of Pins: 6; Clamping Voltage: 17V; Breakdown Voltage: 6V; Lead Free: Lead Free; Radiation Hardening: No; Packaging: Tape and Reel; Mount: Surface Mount; Polarity: Unidirectional
D2 = CMP-1060-01252-1: 24 W Peak Power Zener Transient Voltage Suppressor, Dual Common Anode Zeners for ESD Protection, 3-Pin SOT-23, Tape and Reel; Manufacturer: On Semiconductor; VZ Typ (V): 6.2; PackageVersion: Rev. AP, 11/2009; PackageReference: SOT-23-3-318-08; Mounting Technology: Surface Mount; ComponentLink3URL: http://www.onsemi.cn/pub_link/Collateral/318-08.PDF; ComponentLink1URL: http://www.onsemi.com/; ComponentLink2URL: http://www.onsemi.cn/pub_link/Collateral/MMBZ5V6ALT1-D.PDF; PartNumber: MMBZ6V2ALT1; Packing: Tape and Reel; ComponentLink1Description: Manufacturer URL; DatasheetVersion: Rev. 13; ComponentLink2Description: Datasheet; PackageDescription: 3-Pin Small Outline Transistor, Body 2.92 x 1.3 mm, Pitch 0.95 mm; ComponentLink3Description: Package Specification
J1 J2 = CMP-04776-000071-1: CONN HEADER SMD R/A 3POS 1.25MM; Manufacturer: Molex; Number Of Contacts: 3; Conn Orientation: Right Angle; Current Rating: 1A; Voltage Rating: 125V; Conn Gender: Male; Category: Conn; Automotive: No; Footprint Url: https://www.molex.com/pdm_docs/sd/532610371_sd.pdf; Height: 3.6mm; Number Of Rows: 1; Temperature Range Low: -40°C; Package: 0; Octopart: https://octopart.com/53261-0371-molex-655314; ComponentLink2Description: Datasheet; Lead Free: Yes; Ambient Temperature Range Low: -40°C; Device Class L3: unset; Mouser Description: 1.25mm (.049") Pitch PicoBlade Header, Surface Mount, Right Angle, Lead-free, 3 Circuits; Digikey Description: CONN HEADER SMD R/A 3POS 1.25MM; Device Class L2: Headers and Wire Housings; Contact Material: Tin,Nickel; Manufacturer Part Number: 53261-0371; Ambient Temperature Range High: +105°C; ComponentLink2URL: https://www.molex.com/webdocs/datasheets/pdf/en-us/0532610371_PCB_HEADERS.pdf; Pitch: 1.25mm; Temperature: -40°C to +105°C; RoHS: TRUE; Device Class L1: Connectors; Temperature Range High: +105°C
J4 = CMP-245163-000001-1: CONN RCPT USB2.0 TYPEC 5A; Manufacturer: GCT; Voltage Rating: 20V; Is Female: yes; Current Rating: 5/6.25/1.25/0.25A; Number Of Contacts: 16; Conn Orientation: Right Angle; Device Class L1: Connectors; Category: Conn; Lead Free: Yes; RoHS: TRUE; Temperature Range High: +85°C; Digikey Description: CONN RCPT USB2.0 TYPEC 5A; Device Class L3: unset; ComponentLink2Description: Datasheet; Manufacturer Part Number: USB4105-GF-A; Package: 0; Usb Standard: USB 2.0; Device Class L2: USB Connectors; Automotive: No; Temperature Range Low: -40°C; Height: 3.46mm; Temperature: -40°C to +85°C; Contact Material: Gold,Nickel; ComponentLink2URL: https://gct.co/files/drawings/usb4105.pdf; Octopart: https://octopart.com/usb4105-gf-a-gct-106627878
L2 = CMP-08256-000017-1: CMC 100UH 150MA 2LN SMD AEC-Q200; Shielding: Unshielded; DC Resistance (DCR): 1.5R; Test Frequency: 10MHz; Number of Lines: 2; Voltage Rating (DC): 80V; Impedance: 5.1kR; Tolerance: 50%; Length: 0.154inch; Mount: Surface Mount; Height: 0.098inch; Termination: SMD/SMT; Package Quantity: 6000; Max Current Rating: 150mA; REACH SVHC: No SVHC; Weight: 0.000564oz; Case/Package: 1210; Current Rating: 150mA; Packaging: Tape and Reel; Min Operating Temperature: -55°C; Ratings: AEC-Q200; Width: 0.098inch; Max Operating Temperature: 150°C; Depth: 2.5mm; Lead Free: Lead Free; RoHS Compliant: Yes; Max DC Current: 150mA; Inductance: 100uH
P1 = CMP-1502-00936-2: NexarPartId: 116077963
P2 = CMP-2000-05249-1: Male Header, Pitch 1.25 mm, 1 x 5 Position, Height 3.4 mm, RoHS, Tape and Reel; Brand: Molex; Mounting Angle: Right; Number of Positions: 5; Voltage Rating: 125V; Current Rating: 1A; Pitch: 1.25mm; Datasheet Version: Rev. D, 04/2004; Housing Material: Thermoplastic; Series: 53261; RoHS: Details; Product Category: Headers&WireHousings; Datasheet URL: http://datasheet.octopart.com/532610571-Molex-datasheet-8343080.pdf; Manufacturer URL: http://www.molex.com/; Contact Material: PhosphorBronze; Tradename: PicoBlade; Number of Rows: 1; Product Type: Headers; Manufacturer: Molex; Type: Shrouded; Termination Style: SMD; Mounting Style: SMD/SMT; Factory Pack Quantity: 1000; Contact Plating: Tin; Packaging: Reel; Number of Positions / Contacts: 5
R6 R7 = RT0402BRE075K11L: RES SMD 5.11KOHM 0.1% 1/16W 0402; Manufacturer: Yageo; Power (Watts): 0.063W, 1/16W; Resistance: 5.11 kOhms; Temperature Coefficient: ±50ppm/°C; Part Number: RT0402BRE075K11L; Value: 5k1; ComponentLink1Description: Datasheet; ComponentLink1URL: https://www.yageo.com/upload/media/product/productsearch/datasheet/rchip/PYu-RT_1-to-0.01_RoHS_L_11.pdf; ComponentLink2Description: DigiKey Link; ComponentLink2URL: https://www.digikey.com/en/products/detail/yageo/RT0402BRE075K11L/1069791; Composition: Thin Film; Device Package: 0402 (1005 Metric); Height - Seated (Max): 0.014" (0.35mm); LastUpdated: 9.02.2024 20:30:18; Lifecycle Status: Active; Minimum Order: 1; Number of Terminations: 2; Operating Temperature: -55°C ~ 155°C; Package / Case: 0402 (1005 Metric); Packaging: TapeAndReel; PartId: 3971; Part Status: Active; Price: 0.04; Series: RT; Size / Dimension: 0.039" L x 0.020" W (1.00mm x 0.50mm); Supplier 1: DigiKey; Supplier Part Number 1: YAG4403CT-ND; Supplier Device Package: 0402; Tolerance: ±0.1%
R9 R10 R20 R21 = CR0603-FX-60R4ELF: RES SMD 60.4 OHM 1% 1/10W 0603; Manufacturer: Bourns Inc.; Power (Watts): 0.1W, 1/10W; Resistance: 60.4 Ohms; Temperature Coefficient: ±100ppm/°C; Part Number: CR0603-FX-60R4ELF; ComponentLink1Description: Datasheet; ComponentLink1URL: https://www.bourns.com/docs/Product-Datasheets/CHPREZTR.pdf; ComponentLink2Description: DigiKey Link; ComponentLink2URL: https://www.digikey.com/en/products/detail/bourns-inc/CR0603-FX-60R4ELF/3784116; Composition: Thick Film; Device Package: 0603 (1608 Metric); Features: Moisture Resistant; Height - Seated (Max): 0.022" (0.55mm); LastUpdated: 9.02.2024 20:43:23; Lifecycle Status: Active; Minimum Order: 1; Number of Terminations: 2; Operating Temperature: -55°C ~ 155°C; Package / Case: 0603 (1608 Metric); Packaging: CutTape; PartId: 8152; Part Status: Active; Price: 0.01; Series: CR0603; Size / Dimension: 0.063" L x 0.031" W (1.60mm x 0.80mm); Supplier 1: DigiKey; Supplier Part Number 1: CR0603-FX-60R4ELFCT-ND; Supplier Device Package: 0603; Tolerance: ±1%
  R9 R10: Value: 60
  R20 R21: Value: 22
U7 = CMP-0315-00038-2: 3.3V CAN Transceiver with Standby Mode, Loop-back, 6 mA, -40 to 125 degC, 8-pin SOIC (D), Green (RoHS & no Sb/Br); Manufacturer: Texas Instruments; Rating: Catalog; ICC(Max)(mA): 6; Receivers Per Package: 1; Supply Voltage(s)(V): 3.3; Transient Pulse Protection(V): -100 to 100; Bus Fault Voltage(V): +/-30; Footprint: PCA82C250, excludes pin5; Code_JEDEC: MS-012AA; PackageVersion: revM, Jun-2011; ComponentLink1Description: Datasheet; Mounting Technology: Surface Mount; SubFamily: CAN; DatasheetVersion: SLLS557F; PartNumber: SN65HVD233DR; PackageReference: D0008A; Drivers Per Package: 1; ComponentLink1URL: http://www.ti.com/general/docs/lit/getliterature.tsp?genericPartNumber=SN65HVD233&fileType=pdf; PackageDescription: 8-Pin Plastic Small Outline Integrated Circuit, 4.9 x 3.9 mm, Pitch 1.27 mm Pitch; Eco-Plan: Green (RoHS & no Sb/Br); Features: Loop Back; Low Power Mode: Standby; Isolated: No
U31 = E220-900

## Nets that join several sheets
+3V3: main (21 pins), Sensors (24 pins), Peripheral (C30.1 P1.2 U7.3 U31.6)
GND: main (32 pins), Sensors (25 pins), Peripheral (21 pins)
BMP_CS: main (U8.3), Sensors (U5.6)
BMP_INT: main (U8.2), Sensors (U5.7)
BMP_MISO: main (U8.4), Sensors (U5.5)
BMP_MOSI: main (U8.5), Sensors (U5.4)
BMP_SCK: main (U8.1), Sensors (U5.2)
CAN1_RX: main (U8.95), Peripheral (U7.4)
CAN1_TX: main (U8.96), Peripheral (U7.1)
DBG_RESET: main (U8.14), Peripheral (P1.3)
DBG_SWCLK: main (U8.72), Peripheral (P1.5)
DBG_SWDIO: main (U8.76), Peripheral (P1.1)
~{GNSS_RESET}: main (U8.59), Sensors (R5.2 U1.9)
GNSS_INT: main (U8.62), Sensors (U1.5)
GNSS_RX: main (U8.63), Sensors (R11.1)
GNSS_TX: main (U8.64), Sensors (R8.1)
IMU_CS: main (U8.57), Sensors (U2.12)
IMU_INT1: main (U8.55), Sensors (U2.4)
IMU_INT2: main (U8.56), Sensors (U2.9)
IMU_MISO: main (U8.53), Sensors (U2.1)
IMU_MOSI: main (U8.54), Sensors (U2.14)
IMU_SCL: main (U8.52), Sensors (U2.13)
LoRa_AUX: main (U8.40), Peripheral (U31.5)
LoRa_M0: main (U8.36), Peripheral (U31.1)
LoRa_M1: main (U8.37), Peripheral (U31.2)
LoRa_RXD: main (U8.39), Peripheral (U31.3)
LoRa_TXD: main (U8.38), Peripheral (U31.4)
MAG_DRDY: main (U8.90), Sensors (U4.8)
MAG_INT: main (U8.91), Sensors (U4.7)
MAG_SCL: main (U8.92), Sensors (U4.1)
MAG_SDA: main (U8.93), Sensors (U4.11)
TIM1_CH1: main (U8.67), Peripheral (P2.3)
TIM1_CH2: main (U8.68), Peripheral (P2.4)
TIM3_CH3: main (U8.65), Peripheral (P2.1)
TIM3_CH4: main (U8.66), Peripheral (P2.2)
UART4_RX: main (U8.24), Peripheral (R21.1)
UART4_TX: main (U8.23), Peripheral (R20.1)
USB_D_N: main (U8.70), Peripheral (D1.6)
USB_D_P: main (U8.71), Peripheral (D1.4)